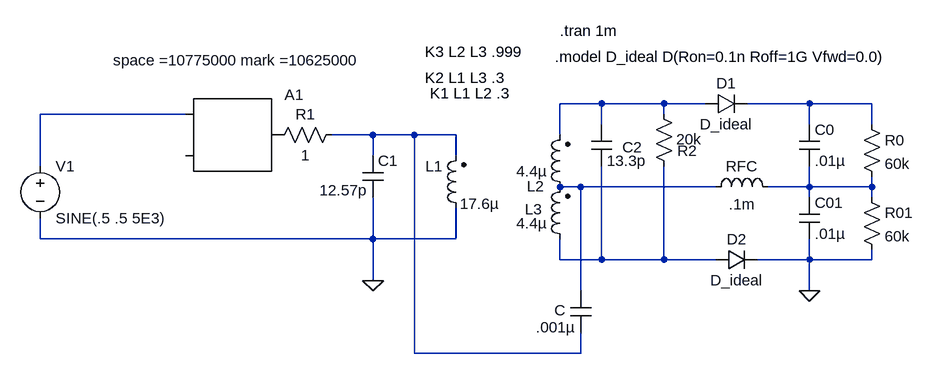
[diagram p0: schematic Foster-Seeley-Simulation.asc]
Foster-Seeley-Simulation.asc, the LTspice schematic file:
Version 4
SHEET 1 956 680
WIRE 384 160 320 160
WIRE 480 160 384 160
WIRE 544 160 480 160
WIRE 704 160 608 160
WIRE 800 160 704 160
WIRE -256 176 -480 176
WIRE 480 176 480 160
WIRE 384 192 384 160
WIRE 704 192 704 160
WIRE 800 192 800 160
WIRE 32 208 -32 208
WIRE 96 208 32 208
WIRE 160 208 96 208
WIRE 320 208 320 160
WIRE 32 240 32 208
WIRE 160 240 160 208
WIRE -480 256 -480 176
WIRE 352 288 320 288
WIRE 560 288 352 288
WIRE 704 288 704 256
WIRE 704 288 640 288
WIRE 800 288 800 272
WIRE 800 288 704 288
WIRE 704 304 704 288
WIRE 800 304 800 288
WIRE -480 368 -480 336
WIRE 32 368 32 304
WIRE 32 368 -480 368
WIRE 160 368 160 320
WIRE 160 368 32 368
WIRE 320 400 320 368
WIRE 384 400 384 256
WIRE 384 400 320 400
WIRE 480 400 480 256
WIRE 480 400 384 400
WIRE 560 400 480 400
WIRE 704 400 704 368
WIRE 704 400 624 400
WIRE 800 400 800 384
WIRE 800 400 704 400
WIRE 32 432 32 368
WIRE 352 448 352 288
WIRE 704 448 704 400
WIRE 96 544 96 208
WIRE 352 544 352 512
WIRE 352 544 96 544
FLAG 32 432 0
FLAG 704 448 0
SYMBOL ind2 176 336 R180
WINDOW 0 36 80 Left 2
WINDOW 3 -51 22 Left 2
SYMATTR InstName L1
SYMATTR Value 17.6µ
SYMATTR Type ind
SYMBOL ind2 336 304 R180
WINDOW 0 43 -18 Left 2
WINDOW 3 36 40 Left 2
SYMATTR InstName L3
SYMATTR Value 4.4µ
SYMATTR Type ind
SYMBOL cap 16 240 R0
WINDOW 3 -66 53 Left 2
SYMATTR Value 12.57p
SYMATTR InstName C1
SYMBOL res 784 176 R0
SYMATTR InstName R0
SYMATTR Value 60k
SYMBOL cap 688 192 R0
SYMATTR InstName C0
SYMATTR Value .01µ
SYMBOL diode 544 176 R270
WINDOW 0 32 32 VTop 2
WINDOW 3 0 32 VBottom 2
SYMATTR InstName D1
SYMATTR Value D_ideal
SYMBOL diode 560 416 R270
WINDOW 0 32 32 VTop 2
WINDOW 3 0 32 VBottom 2
SYMATTR InstName D2
SYMATTR Value D_ideal
SYMBOL cap 688 304 R0
SYMATTR InstName C01
SYMATTR Value .01µ
SYMBOL cap 368 192 R0
WINDOW 0 48 35 Left 2
SYMATTR InstName C2
SYMATTR Value 13.3p
SYMBOL res 784 288 R0
SYMATTR InstName R01
SYMATTR Value 60k
SYMBOL ind 544 304 R270
WINDOW 0 32 56 VTop 2
WINDOW 3 5 56 VBottom 2
SYMATTR InstName RFC
SYMATTR Value .1m
SYMBOL res -16 192 R90
WINDOW 0 0 56 VBottom 2
WINDOW 3 32 56 VTop 2
SYMATTR InstName R1
SYMATTR Value 1
SYMBOL cap 368 512 R180
WINDOW 0 39 34 Left 2
WINDOW 3 24 8 Left 2
SYMATTR InstName C
SYMATTR Value .001µ
SYMBOL res 464 160 R0
WINDOW 0 37 72 Left 2
WINDOW 3 35 55 Left 2
SYMATTR InstName R2
SYMATTR Value 20k
SYMBOL ind2 336 384 R180
WINDOW 0 40 97 Left 2
WINDOW 3 36 40 Left 2
SYMATTR InstName L2
SYMATTR Value 4.4µ
SYMATTR Type ind
SYMBOL SpecialFunctions/modulate -256 176 R0
WINDOW 3 -112 -83 Left 2
SYMATTR Value space =10775000 mark =10625000
SYMATTR InstName A1
SYMBOL voltage -480 240 R0
SYMATTR InstName V1
SYMATTR Value SINE(.5 .5 5E3)
TEXT 312 88 Left 2 !.model D_ideal D(Ron=0.1n Roff=1G Vfwd=0.0)
TEXT 112 120 Left 2 !K2 L1 L3 .3
TEXT 112 80 Left 2 !K3 L2 L3 .999
TEXT 120 144 Left 2 !K1 L1 L2 .3
TEXT 320 48 Left 2 !.tran 1m

The netlist it stands for:
* Foster-Seeley-Simulation.asc
L1 0 N004 17.6µ
L3 N005 N001 4.4µ
C1 N004 0 12.57p
R0 N002 N006 60k
C0 N002 N006 .01µ
D1 N001 N002 D_ideal
D2 N007 0 D_ideal
C01 N006 0 .01µ
C2 N001 N007 13.3p
R01 N006 0 60k
L§RFC N005 N006 .1m
R1 N004 P001 1
C N004 N005 .001µ
R2 N001 N007 20k
L2 N007 N005 4.4µ
A1 N003 0 0 0 0 0 P001 0 MODULATOR space =10775000 mark =10625000
V1 N003 0 SINE(.5 .5 5E3)
.model D D
.lib standard.dio
.model D_ideal D(Ron=0.1n Roff=1G Vfwd=0.0)
K2 L1 L3 .3
K3 L2 L3 .999
K1 L1 L2 .3
.tran 1m
.backanno
.end